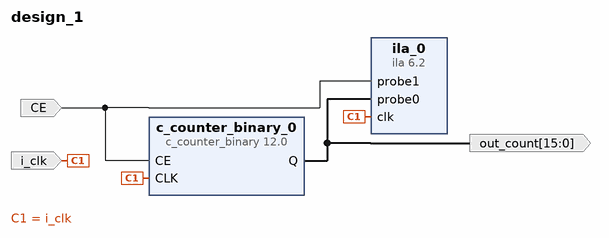
[diagram p0: block diagram of the top level]
# Vivado block design design_1, xc7a35tftg256-1, Vivado 2022.2
create_bd_design design_1

create_bd_port -dir I -type ce CE
set_property -dict {CONFIG.POLARITY ACTIVE_HIGH} [get_bd_ports CE]
create_bd_port -dir I -type clk i_clk
set_property -dict {CONFIG.FREQ_HZ 50000000} [get_bd_ports i_clk]
create_bd_port -dir O -from 15 -to 0 -type data out_count

create_bd_cell -type ip -vlnv xilinx.com:ip:ila:6.2 ila_0
set_property -dict [list \
  CONFIG.C_EN_STRG_QUAL 1 \
  CONFIG.C_MONITOR_TYPE Native \
  CONFIG.C_NUM_OF_PROBES 2 \
  CONFIG.C_PROBE0_WIDTH 16 \
] [get_bd_cells ila_0]
create_bd_cell -type ip -vlnv xilinx.com:ip:c_counter_binary:12.0 c_counter_binary_0
set_property -dict {CONFIG.CE true} [get_bd_cells c_counter_binary_0]

# ---- connections ----

connect_bd_net -net CE_0_1 [get_bd_ports CE] [get_bd_pins c_counter_binary_0/CE] [get_bd_pins ila_0/probe1]
connect_bd_net [get_bd_pins c_counter_binary_0/Q] [get_bd_pins ila_0/probe0] [get_bd_ports out_count]
connect_bd_net -net clk_wiz_0_clk_out1 [get_bd_ports i_clk] [get_bd_pins c_counter_binary_0/CLK] [get_bd_pins ila_0/clk]

validate_bd_design
save_bd_design
